# EAGLE design PFD for MobiFlight (EAGLE 9.6.2)
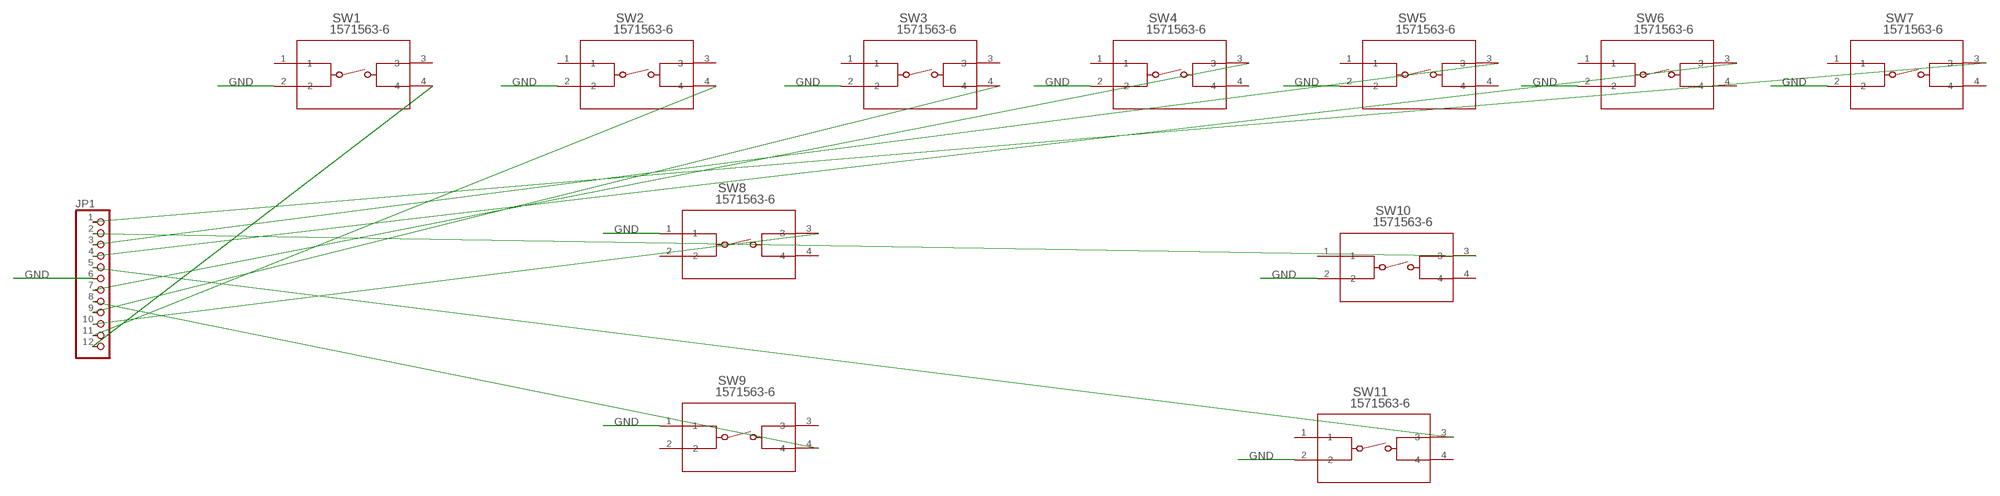
[diagram p0: schematic, sheet 1]

## Parts
JP1  PINHD-1X12  [1X12]
SW1  1571563-6  [SW4_1437565-E]
SW2  1571563-6  [SW4_1437565-E]
SW3  1571563-6  [SW4_1437565-E]
SW4  1571563-6  [SW4_1437565-E]
SW5  1571563-6  [SW4_1437565-E]
SW6  1571563-6  [SW4_1437565-E]
SW7  1571563-6  [SW4_1437565-E]
SW8  1571563-6  [SW4_1437565-E]
SW9  1571563-6  [SW4_1437565-E]
SW10  1571563-6  [SW4_1437565-E]
SW11  1571563-6  [SW4_1437565-E]

## Nets
GND: JP1.6 SW1.2 SW2.2 SW3.2 SW4.2 SW5.2 SW6.2 SW7.2 SW8.1 SW9.1 SW10.2 SW11.2
N$1: JP1.7 SW4.3
N$2: JP1.9 SW3.4
N$3: JP1.8 SW9.4
N$4: JP1.10 SW8.3
N$5: JP1.11 SW2.4
N$6: JP1.12 SW1.4
N$7: JP1.3 SW5.3
N$8: JP1.5 SW11.3
N$9: JP1.4 SW6.3
N$10: JP1.1 SW7.3
N$11: JP1.2 SW10.3
Unconnected: SW1.1 SW1.3 SW2.1 SW2.3 SW3.1 SW3.3 SW4.1 SW4.4 SW5.1 SW5.4 SW6.1 SW6.4 SW7.1 SW7.4 SW8.2 SW8.4 SW9.2 SW9.3 SW10.1 SW10.4 SW11.1 SW11.4

## Library data of the parts
JP1 = adafruit:PINHD-1X12: PIN HEADER
SW1-SW11 = Switches:1571563-6; BUILT_BY: EMA_UL_Team; CATEGORY: Tactile Switches; COPYRIGHT: Copyright (C) 2016 Accelerated Designs. All rights reserved; DESCRIPTION: FSM14JSMAATR=TACT,SMT,T&R; MANUFACTURER_PART_NUMBER: 1571563-6; PART_STATUS: active; SERIES: Alcoswitch FSMJSMA; VENDOR: TE Connectivity

## Board
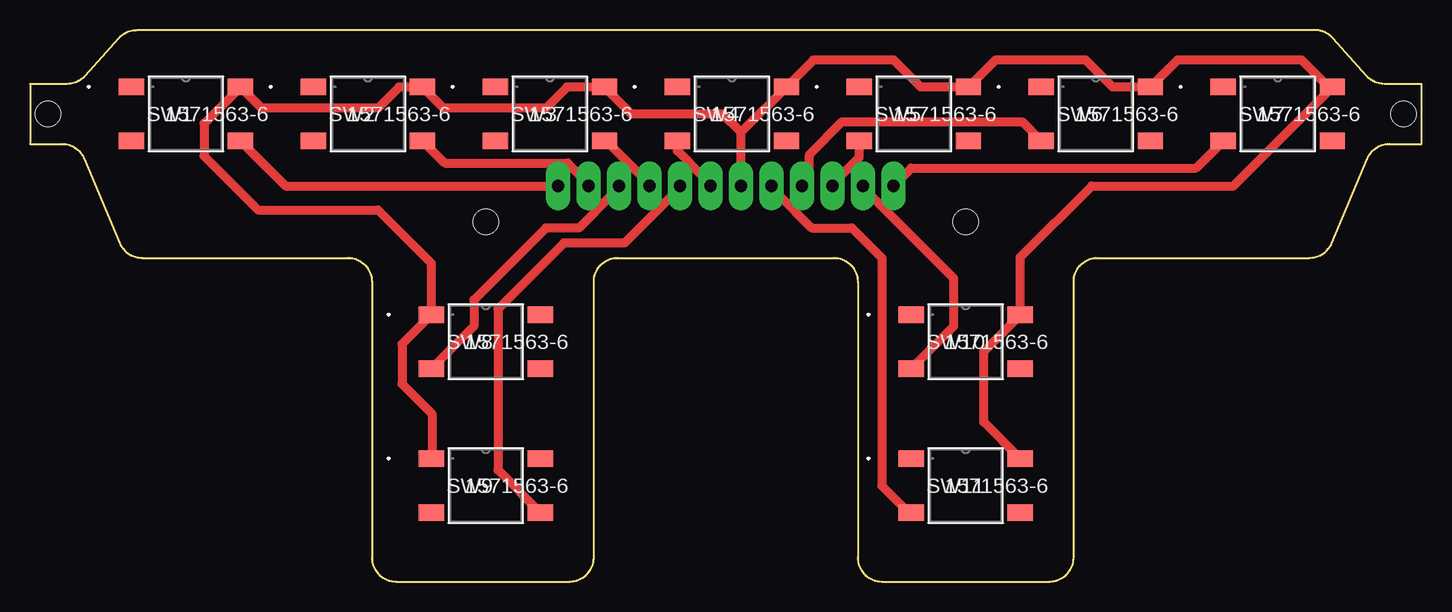
[diagram p1: board, top side]
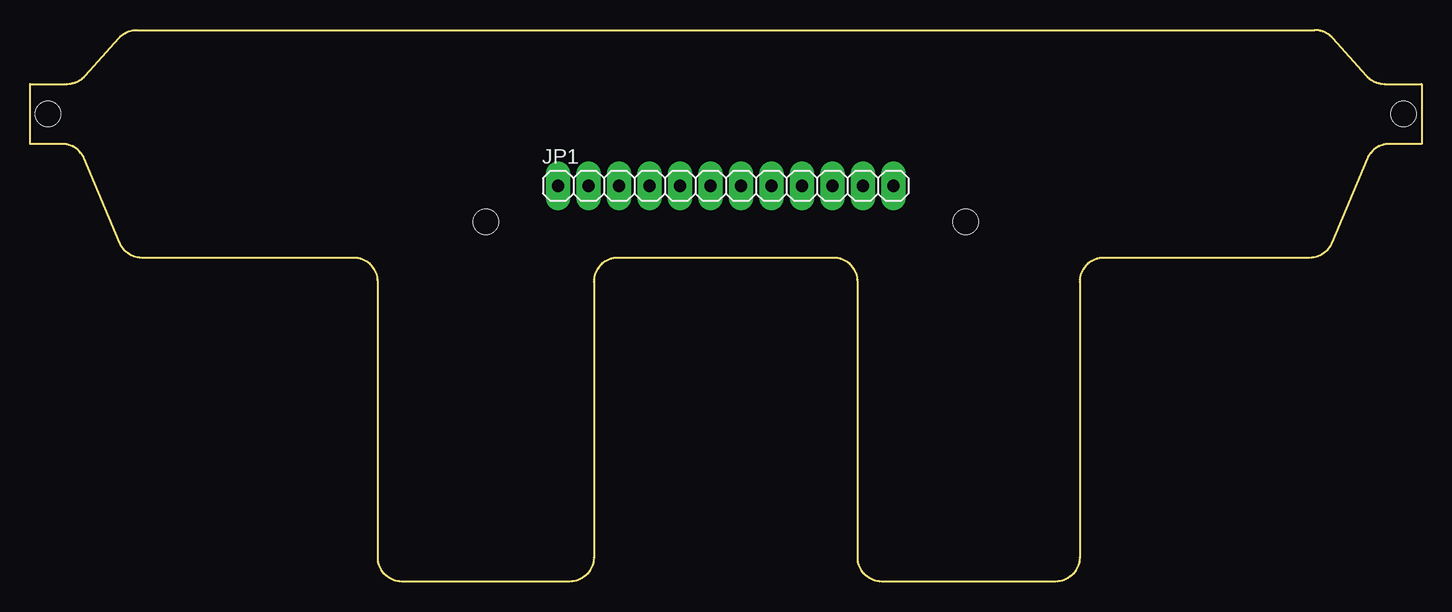
[diagram p2: board, bottom side, seen from below]

Size 116 x 46 mm. Coordinates in mm from the lower left corner, seen from the top.
Outline: 4.51,35.28 7.48,28.22 arc67 9.33,27 26.5,27 arc-90 28.5,25 28.5,2 arc90 30.5,0 45,0 arc90 47,2 47,25 arc-90 49,27 67,27 arc-90 69,25 69,2 arc90 71,0 85,0 arc90 87,2 87,25 arc-90 89,27 106.67,27 arc67 108.52,28.22 111.48,35.28 arc-67 113.33,36.5 116,36.5 116,41.5 112.9,41.5 arc-48 111.4,42.17 108.6,45.33 arc48 107.1,46 8.9,46 arc48 7.4,45.33 4.6,42.17 arc-48 3.1,41.5 0,41.5 0,36.5 2.67,36.5 arc-67 4.51,35.28
Copper layers (1*16): Top 0.035mm / dielectric 1.5mm / Bottom 0.035mm
Design rules "swidzi_milling_3018_tht_test": minimum track width 20mil, minimum drill 0.8mm, track to track 20mil, track to pad 20mil, pad to pad 20mil, via to via 6mil, smd to smd 6mil, copper to edge 15mil, drill to drill 6mil, minimum pad ring 10mil, minimum via ring 8mil, stop-mask expansion 4mil, vias tented up to drill 0mil, thermal gap 10mil
Holes 2.1 mm at 38,30 78,30 1.5,39 114.5,39

### Footprints (pad centres in the part's own frame; a part is rotated, then mirrored left to right if it is on the bottom)
1X12 = drill 1.016 long: 1 -13.97,0; 2 -11.43,0; 3 -8.89,0; 4 -6.35,0; 5 -3.81,0; 6 -1.27,0; 7 1.27,0; 8 3.81,0; 9 6.35,0; 10 8.89,0; 11 11.43,0; 12 13.97,0
SW4_1437565-E = smd 2.108 x 1.397: 1 -4.55,2.25; 2 4.55,2.25; 3 -4.55,-2.25; 4 4.55,-2.25

### Placement (x,y rotation side)
JP1  58,33 0 bottom
SW1  13,39 0 top
SW2  28.17,39 0 top
SW3  43.34,39 0 top
SW4  58.51,39 0 top
SW5  73.68,39 0 top
SW6  88.85,39 0 top
SW7  104.02,39 0 top
SW8  38,20 0 top
SW9  38,8 0 top
SW10  78,20 0 top
SW11  78,8 0 top

### Tracks (layer width: path | path; a pad name or v marks a point on that pad's centre or on a via)
GND
  Top 0.762: JP1.6 59.27,37.46 | 59.27,37.46 SW4.2 65.31,43.5 72,43.5 74.25,41.25 SW5.2 80.48,43.5 88,43.5 90.25,41.25 SW6.2 95.65,43.5 106,43.5 108.25,41.25 SW7.2 100.32,33 88.5,33 82.55,27.05 SW10.2 79.5,19.2 79.5,13.3 SW11.2 | 59.27,37.46 57.73,39 50.14,39 SW3.2 44.75,41.25 43,39.5 34.47,39.5 SW2.2 30.75,41.25 29,39.5 19.3,39.5 SW1.2 14.5,38.2 14.5,35.5 19,31 29,31 33.45,26.55 SW8.1 31,19.8 31,16.5 33.5,14 33.5,10.3 SW9.1
N$1
  Top 0.762: JP1.7 56.09,33.63 56.09,33.79 53.96,35.92 SW4.3
N$2
  Top 0.762: JP1.9 51.02,33.63 51.02,33.79 48.05,36.75 SW3.4
N$3
  Top 0.762: JP1.8 53.55,32.37 53.55,32.21 49.57,28.23 44.5,28.23 39,22.73 39,9.3 SW9.4
N$4
  Top 0.762: JP1.10 48.48,32.37 48.48,32.21 45.76,29.5 43,29.5 37,23.5 37,21.3 SW8.3
N$5
  Top 0.762: JP1.11 45.94,33.63 45.94,33.79 44.82,34.91 34.56,34.91 SW2.4
N$6
  Top 0.762: SW1.4 21.3,33 JP1.12
N$7
  Top 0.762: JP1.3 67.53,33.63 67.53,33.79 69.13,35.39 SW5.3
N$8
  Top 0.762: JP1.5 62.44,32.37 62.44,32.21 65.16,29.5 68.5,29.5 71,27 71,8 73.25,5.75 SW11.3
N$9
  Top 0.762: JP1.4 64.98,33.63 64.98,35.62 67.71,38.34 82.71,38.34 SW6.3
N$10
  Top 0.762: JP1.1 73.47,34.5 97.22,34.5 SW7.3
N$11
  Top 0.762: SW10.3 77,21.3 77,25.28 70.06,32.21 70.06,32.37 JP1.2